# Altium schematic sheet STM32F103C8T6.SchDoc
size A4
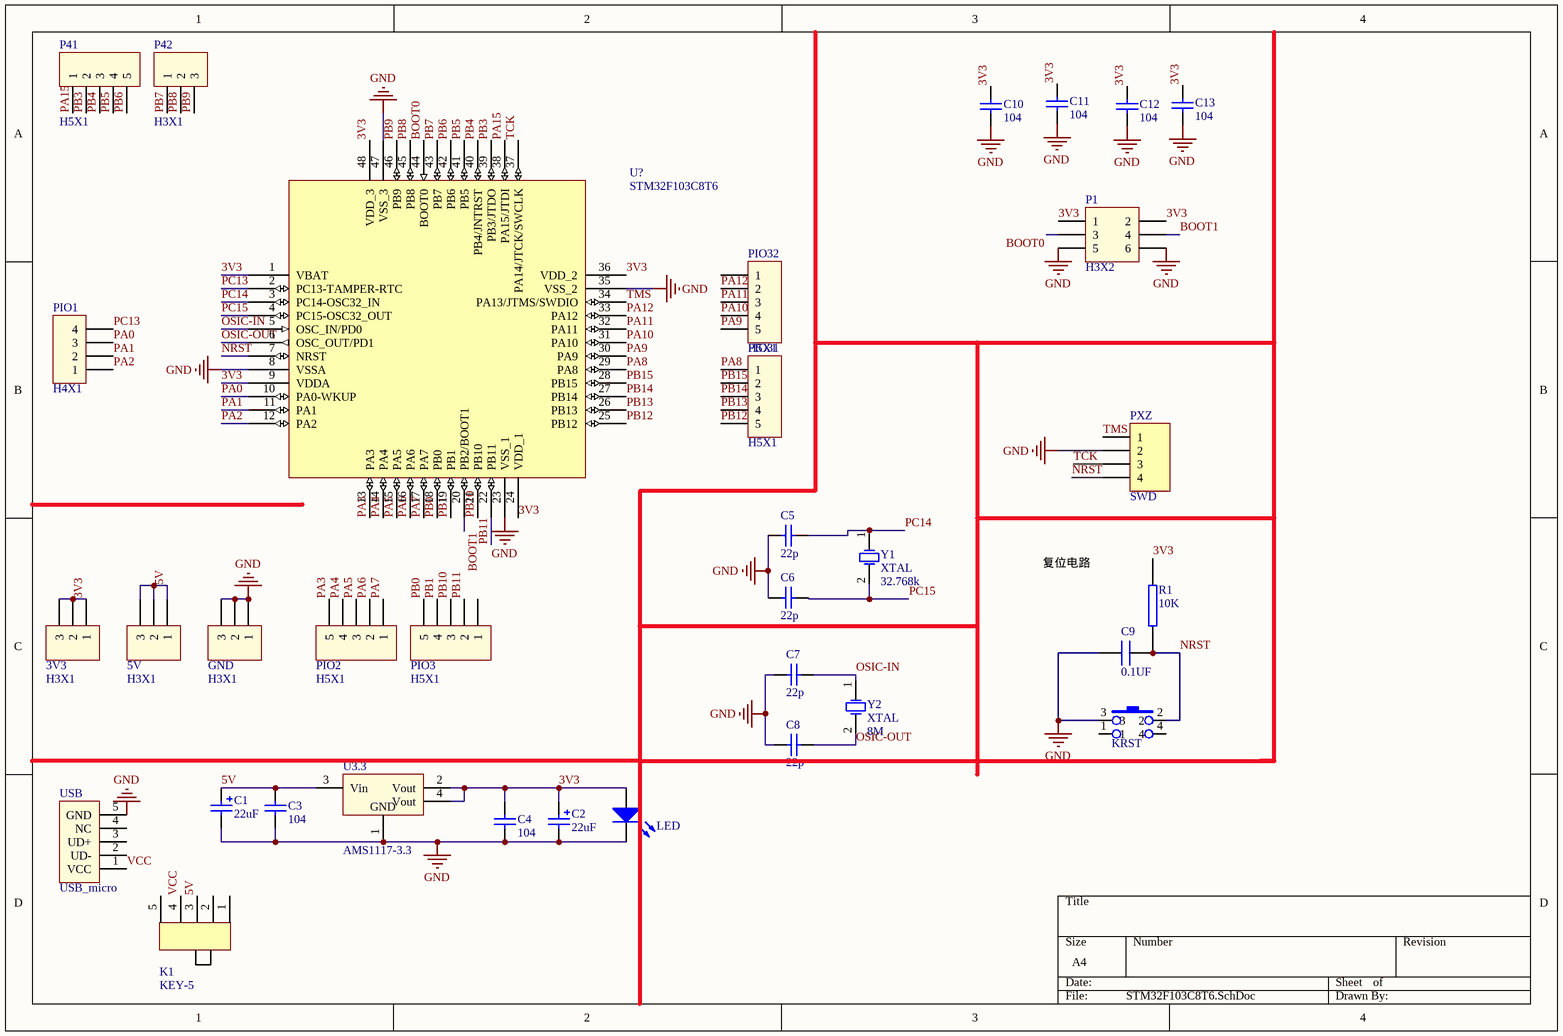
[diagram p0: STM32F103C8T6.SchDoc]

## Parts
3V3  H3X1  [H2.54-1X3]
5V  H3X1  [H2.54-1X3]
C1  Cap Pol(22uF)  [CAP[1210]]  (value not drawn)
C2  Cap Pol(22uF)  [CAP[1210]]  (value not drawn)
C3  Cap  [CAP[0805]]  (value not drawn)
C4  Cap  [CAP[0805]]  (value not drawn)
C5  Cap  [CAP[0805]]  (value not drawn)
C6  Cap  [CAP[0805]]  (value not drawn)
C7  Cap  [CAP[0805]]  (value not drawn)
C8  Cap  [CAP[0805]]  (value not drawn)
C9  0.1UF  [CAP[0805]]
C10  Cap  [CAP[0805]]  (value not drawn)
C11  Cap  [CAP[0805]]  (value not drawn)
C12  Cap  [CAP[0805]]  (value not drawn)
C13  Cap  [CAP[0805]]  (value not drawn)
GND  H3X1  [H2.54-1X3]
K1  KEY-5  [KEY-5]
KRST  SW-66B7  [KEY-2(SMD)]  (value not drawn)
LED  LED0  [LED[0805]]  (value not drawn)
P1  H3X2  [H2.54-2X3]
P41  H5X1  [H2.54-1X5]
P42  H3X1  [H2.54-1X3]
PIO1  H4X1  [H2.54-1X4]
PIO2  H5X1  [H2.54-1X5]
PIO3  H5X1  [H2.54-1X5]
PIO31  H5X1  [H2.54-1X5]
PIO32  H5X1  [H2.54-1X5]
PXZ  SWD  [HDR1X4]
R1  10K  [R0805]
U3.3  AMS1117-3.3  [SOT-223(AMS1117-3.3)]
U?  STM32F103C8T6  [LQFP48_N]
USB  USB_micro  [USB(Micro)]
Y1  XTAL  [XTAL-DT38-SMD]
Y2  XTAL  [XTAL]

## Nets
GND: C1.2 C2.2 C3.1 C4.1 C5.2 C6.2 C7.2 C8.2 C9.1 C10.1 C11.1 C12.1 C13.1 GND.1 GND.2 GND.3 KRST.3 LED.2(K) P1.5 P1.6 PXZ.2 U3.3.1(GND) U?.8(VSSA) U?.23(VSS_1) U?.35(VSS_2) U?.47(VSS_3) USB.5(GND)
3V3: 3V3.1 3V3.2 3V3.3 C2.1 C4.2 C10.2 C11.2 C12.2 C13.2 LED.1(A) P1.1 P1.2 R1.2 U3.3.2(Vout) U3.3.4(Vout) U?.1(VBAT) U?.9(VDDA) U?.24(VDD_1) U?.36(VDD_2) U?.48(VDD_3)
5V: 5V.1 5V.2 5V.3 C1.1 C3.2 K1.3 U3.3.3(Vin)
BOOT0: P1.3 U?.44(BOOT0)
BOOT1: P1.4 U?.20(PB2/BOOT1)
NRST: C9.2 KRST.2 PXZ.4 R1.1 U?.7(NRST)
OSIC-IN: C7.1 U?.5(OSC_IN/PD0) Y2.1(OSC1)
OSIC-OUT: C8.1 U?.6(OSC_OUT/PD1) Y2.2(OSC2)
PA0: PIO1.3 U?.10(PA0-WKUP)
PA1: PIO1.2 U?.11(PA1)
PA2: PIO1.1 U?.12(PA2)
PA3: PIO2.5 U?.13(PA3)
PA4: PIO2.4 U?.14(PA4)
PA5: PIO2.3 U?.15(PA5)
PA6: PIO2.2 U?.16(PA6)
PA7: PIO2.1 U?.17(PA7)
PA8: PIO31.1 U?.29(PA8)
PA9: PIO32.5 U?.30(PA9)
PA10: PIO32.4 U?.31(PA10)
PA11: PIO32.3 U?.32(PA11)
PA12: PIO32.2 U?.33(PA12)
PA15: P41.1 U?.38(PA15/JTDI)
PB0: PIO3.5 U?.18(PB0)
PB1: PIO3.4 U?.19(PB1)
PB3: P41.2 U?.39(PB3/JTDO)
PB4: P41.3 U?.40(PB4/JNTRST)
PB5: P41.4 U?.41(PB5)
PB6: P41.5 U?.42(PB6)
PB7: P42.1 U?.43(PB7)
PB8: P42.2 U?.45(PB8)
PB9: P42.3 U?.46(PB9)
PB10: PIO3.3 U?.21(PB10)
PB11: PIO3.2 U?.22(PB11)
PB12: PIO31.5 U?.25(PB12)
PB13: PIO31.4 U?.26(PB13)
PB14: PIO31.3 U?.27(PB14)
PB15: PIO31.2 U?.28(PB15)
PC13: PIO1.4 U?.2(PC13-TAMPER-RTC)
PC14: C5.1 U?.3(PC14-OSC32_IN) Y1.1(OSC1)
PC15: C6.1 U?.4(PC15-OSC32_OUT) Y1.2(OSC2)
TCK: PXZ.3 U?.37(PA14/JTCK/SWCLK)
TMS: PXZ.1 U?.34(PA13/JTMS/SWDIO)
VCC: K1.4 USB.1(VCC)

Not connected (* = marked no-connect by the designer): K1 1 2 5; KRST 1 4; PIO3 1; PIO32 1; USB 2(UD-) 3(UD+) 4(NC)

## Notes on the sheet
- (near R1) 复位电路
- (in symbol Cap) 104; 22p
- (in symbol Cap Pol(22uF)) 22uF
- (in symbol XTAL) 32.768k; 8M

## Library data of the parts
C9 = 普通贴片电容: Capacitor
PXZ = Header 4: Header, 4-Pin; LatestRevisionDate: 17-Jul-2002; LatestRevisionNote: Re-released for DXP Platform.; Publisher: Altium Limited
R1 = RES
U? = STM32F103C8T6: STM32 ARM-based 32-bit MCU with 64 Kbytes Flash, 48-pin LQFP, Industrial Temperature; Published: *; DatasheetVersion: *; PackageVersion: *; PackageReference: *; Publisher: *; PackageDescription: *; ComponentLink1Description: *; ComponentLink1URL: *; ComponentLink2Description: *; ComponentLink2URL: *